# EAGLE design Trinkey-DualSwitch-Concept3 (EAGLE 9.6.2)
AUTHOR: ladyada
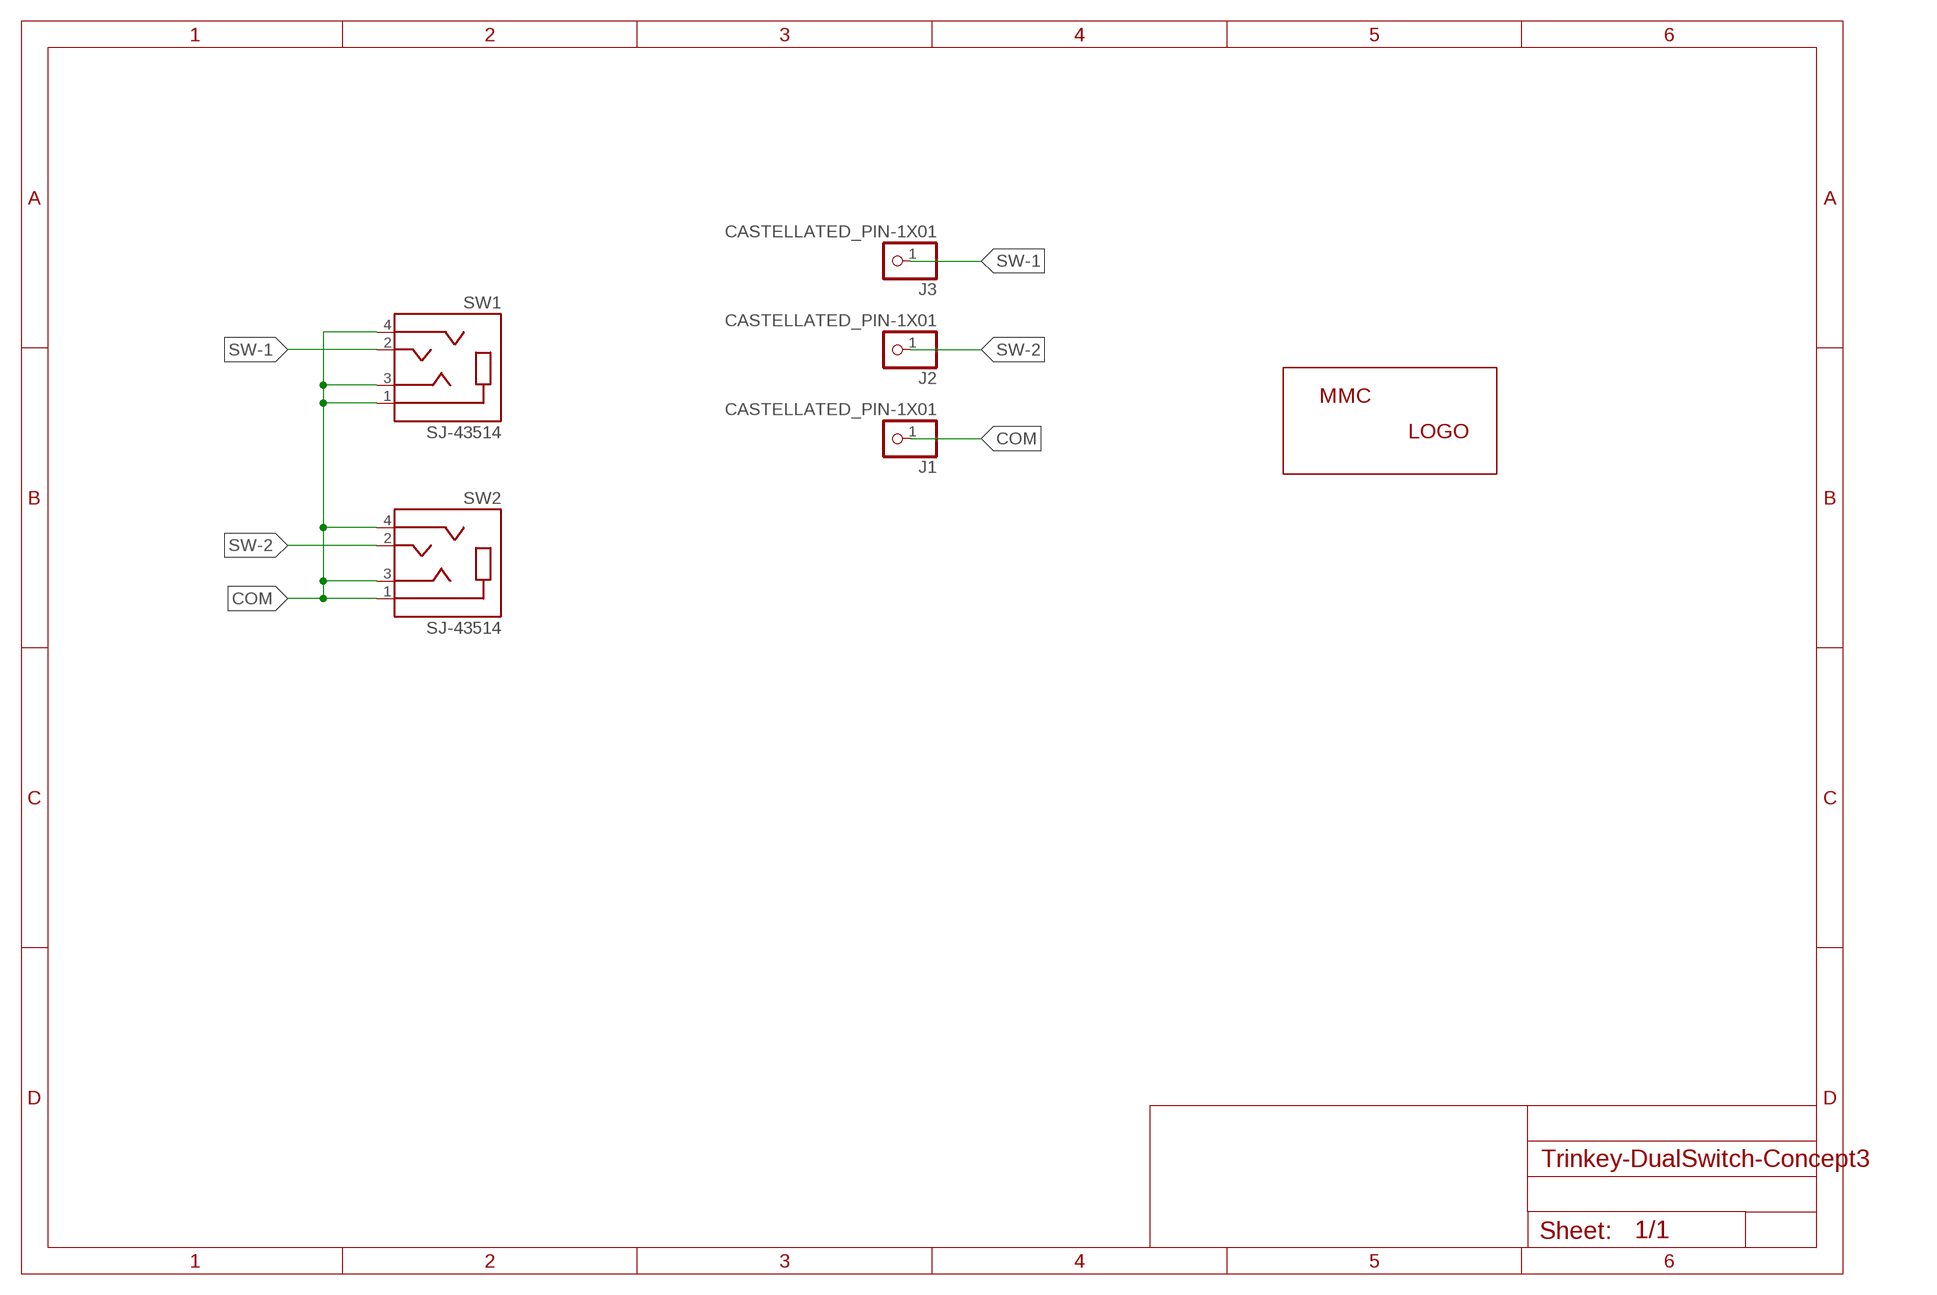
[diagram p0: schematic, sheet 1]

## Parts
J1  CASTELLATED_PIN-1X01  [CASTELLATED_PIN-1X01]
J2  CASTELLATED_PIN-1X01  [CASTELLATED_PIN-1X01]
J3  CASTELLATED_PIN-1X01  [CASTELLATED_PIN-1X01]
LABEL_LOGO  MMC_LOGO-XSM  [MMC_X-SMALL_LOGO]
SW1  SJ-43514  [CUI_SJ-43514]
SW2  SJ-43514  [CUI_SJ-43514]

## Nets
COM: J1.1 SW1.1(SLEEVE) SW1.3(RING1) SW1.4(RING2) SW2.1(SLEEVE) SW2.3(RING1) SW2.4(RING2)
SW-1: J3.1 SW1.2(TIP)
SW-2: J2.1 SW2.2(TIP)

## Library data of the parts
J1-J3 = MMC Eagle:CASTELLATED_PIN-1X01
LABEL_LOGO = MMC Eagle:MMC_LOGO-
SW1 SW2 = MMC Eagle:SJ-43514: SJ-43514 3.50mm (0.141", 1/8", Mini Plug) - Headphone Phone Jack Stereo (4 Conductor, TRRS) Connector. You can use these as jacks to connect analog joysticks or create simple switch interfaces. Options: Digikey - CP-43514-ND <https://www.digikey.ca/en/products/detail/cui-devices/SJ-43514/368146> Mouser - 490-SJ-43514 <https://www.mouser.ca/ProductDetail/CUI-Devices/SJ-43514?qs=WyjlAZoYn51bsBOfuwwiuw%3D%3D>

## Board
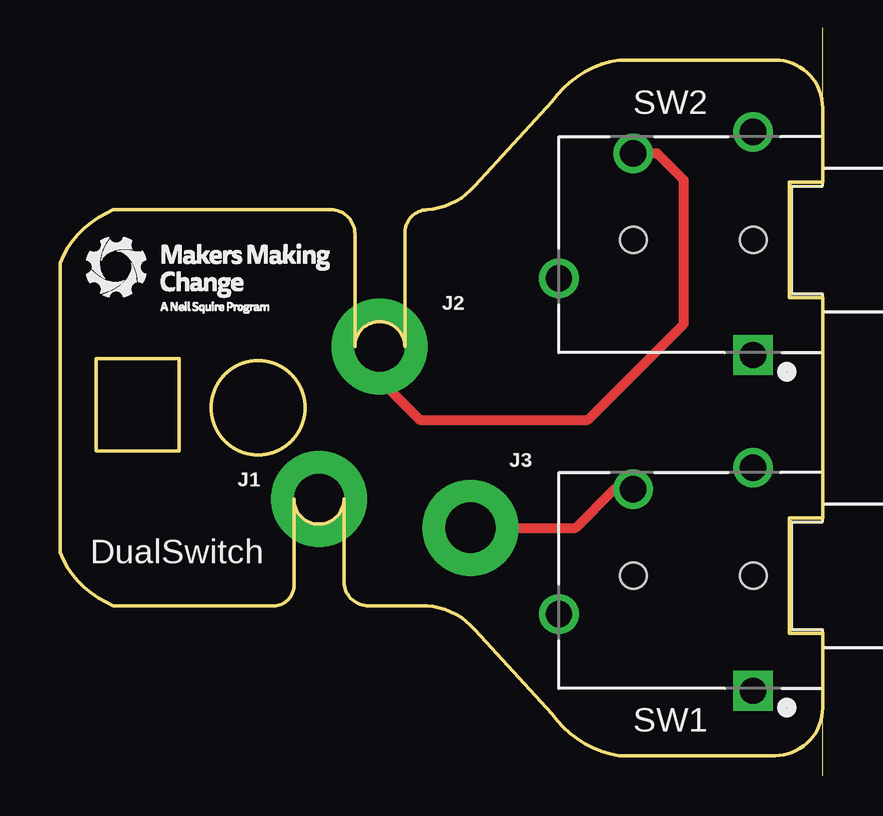
[diagram p1: board, top side]
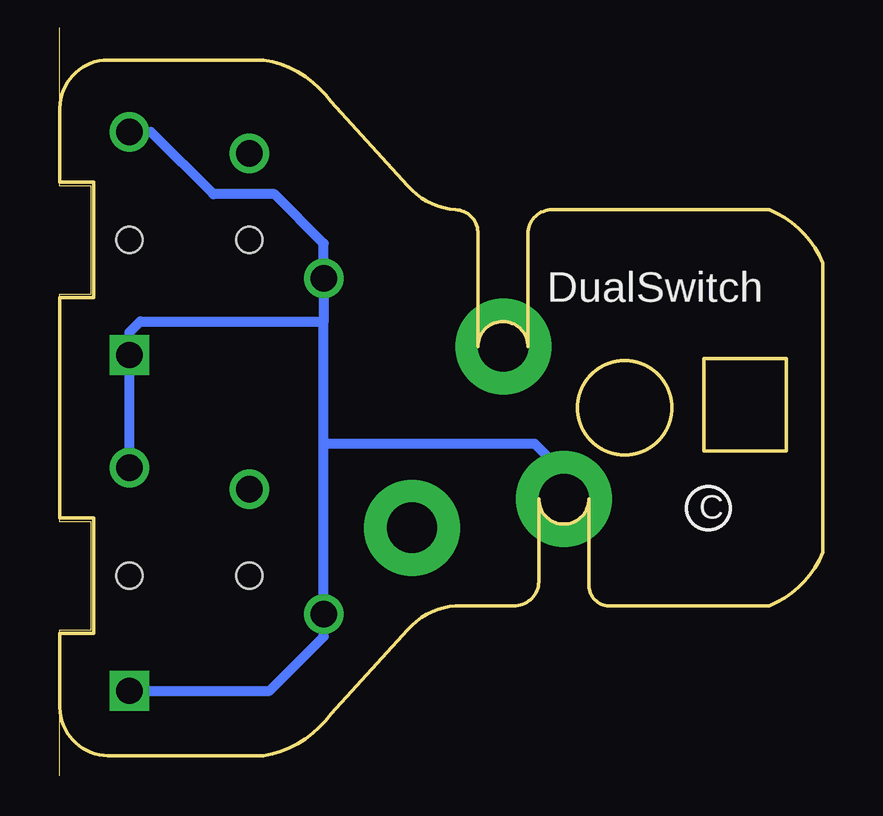
[diagram p2: board, bottom side, seen from below]

Size 31.8 x 29 mm. Coordinates in mm from the lower left corner, seen from the top.
Outline: 0,20.53 arc-45 2.22,22.75 11.29,22.75 arc-90 12.29,21.75 12.29,17.05 arc-90 13.32,18.09 arc-90 14.38,17.05 14.38,21.75 arc-90 15.3,22.75 arc45 17.3,23.75 20.5,27.25 arc-45 23.3,29 29.8,29 arc-90 31.8,27 31.8,23.9 30.4,23.9 30.4,19.1 31.8,19.1 31.8,9.9 30.4,9.9 30.4,5.1 31.8,5.1 31.8,2 arc-90 29.8,0 23.3,0 arc-45 20.5,1.75 17.3,5.25 arc45 15.3,6.25 12.88,6.25 arc-90 11.84,7.25 11.84,10.69 arc-90 10.79,9.65 arc-90 9.75,10.69 9.75,7 arc-90 8.75,6.25 2.22,6.25 arc-45 0,8.47 0,20.53
Outline: circle at 8.26,14.5 radius 1.95
Copper layers (1*16): Top 0.035mm / dielectric 1.5mm / Bottom 0.035mm
Design rules "adafruit 8-8 *": minimum track width 8mil, minimum drill 15.5mil, track to track 8mil, track to pad 8mil, pad to pad 8mil, via to via 8mil, smd to smd 8mil, copper to edge 10mil, drill to drill 8mil, minimum pad ring 10mil, minimum via ring 8mil, stop-mask expansion 2mil, vias tented up to drill 20mil, thermal gap 10mil
Milling: 4 lines

### Footprints (pad centres in the part's own frame; a part is rotated, then mirrored left to right if it is on the bottom)
CASTELLATED_PIN-1X01 = drill 2.086 pad 4: 1 0,0
CUI_SJ-43514 = drill 1.1 square: 1 -2.6,4.8 | drill 1.1: 2 2.4,-3.6; 3 5.5,1.6; 4 -2.6,-4.5 | hole 1.1: -2.6,0; 2.4,0

### Placement (x,y rotation side)
J1  10.79,10.69 0 top
J2  13.32,17.05 0 top
J3  17.12,9.5 0 top
LABEL_LOGO  6.08,18.45 0 top
SW1  26.3,7.5 180 top
SW2  26.3,21.5 180 top

### Tracks (layer width: path | path; a pad name or v marks a point on that pad's centre or on a via)
COM
  Bottom 0.406: SW2.4 28,26 25.4,23.4 22.85,23.4 20.8,21.35 SW2.3 20.8,18.1 | SW1.1 23.05,2.7 20.8,4.95 SW1.3 20.8,13 | 20.8,13 20.8,18.1 | SW1.4 SW2.1 28.9,17.65 28.45,18.1 20.8,18.1 | J1.1 10.79,11.79 12,13 20.8,13
SW-1
  Top 0.406: J3.1 21.5,9.5 23.1,11.1 SW1.2
SW-2
  Top 0.406: J2.1 13.32,15.68 15,14 22,14 26,18 26,24 24.9,25.1 SW2.2

### Text on the board
tPlace: DualSwitch
bPlace: DualSwitch | C